# EAGLE design TeensyROM (EAGLE 7.7.0)
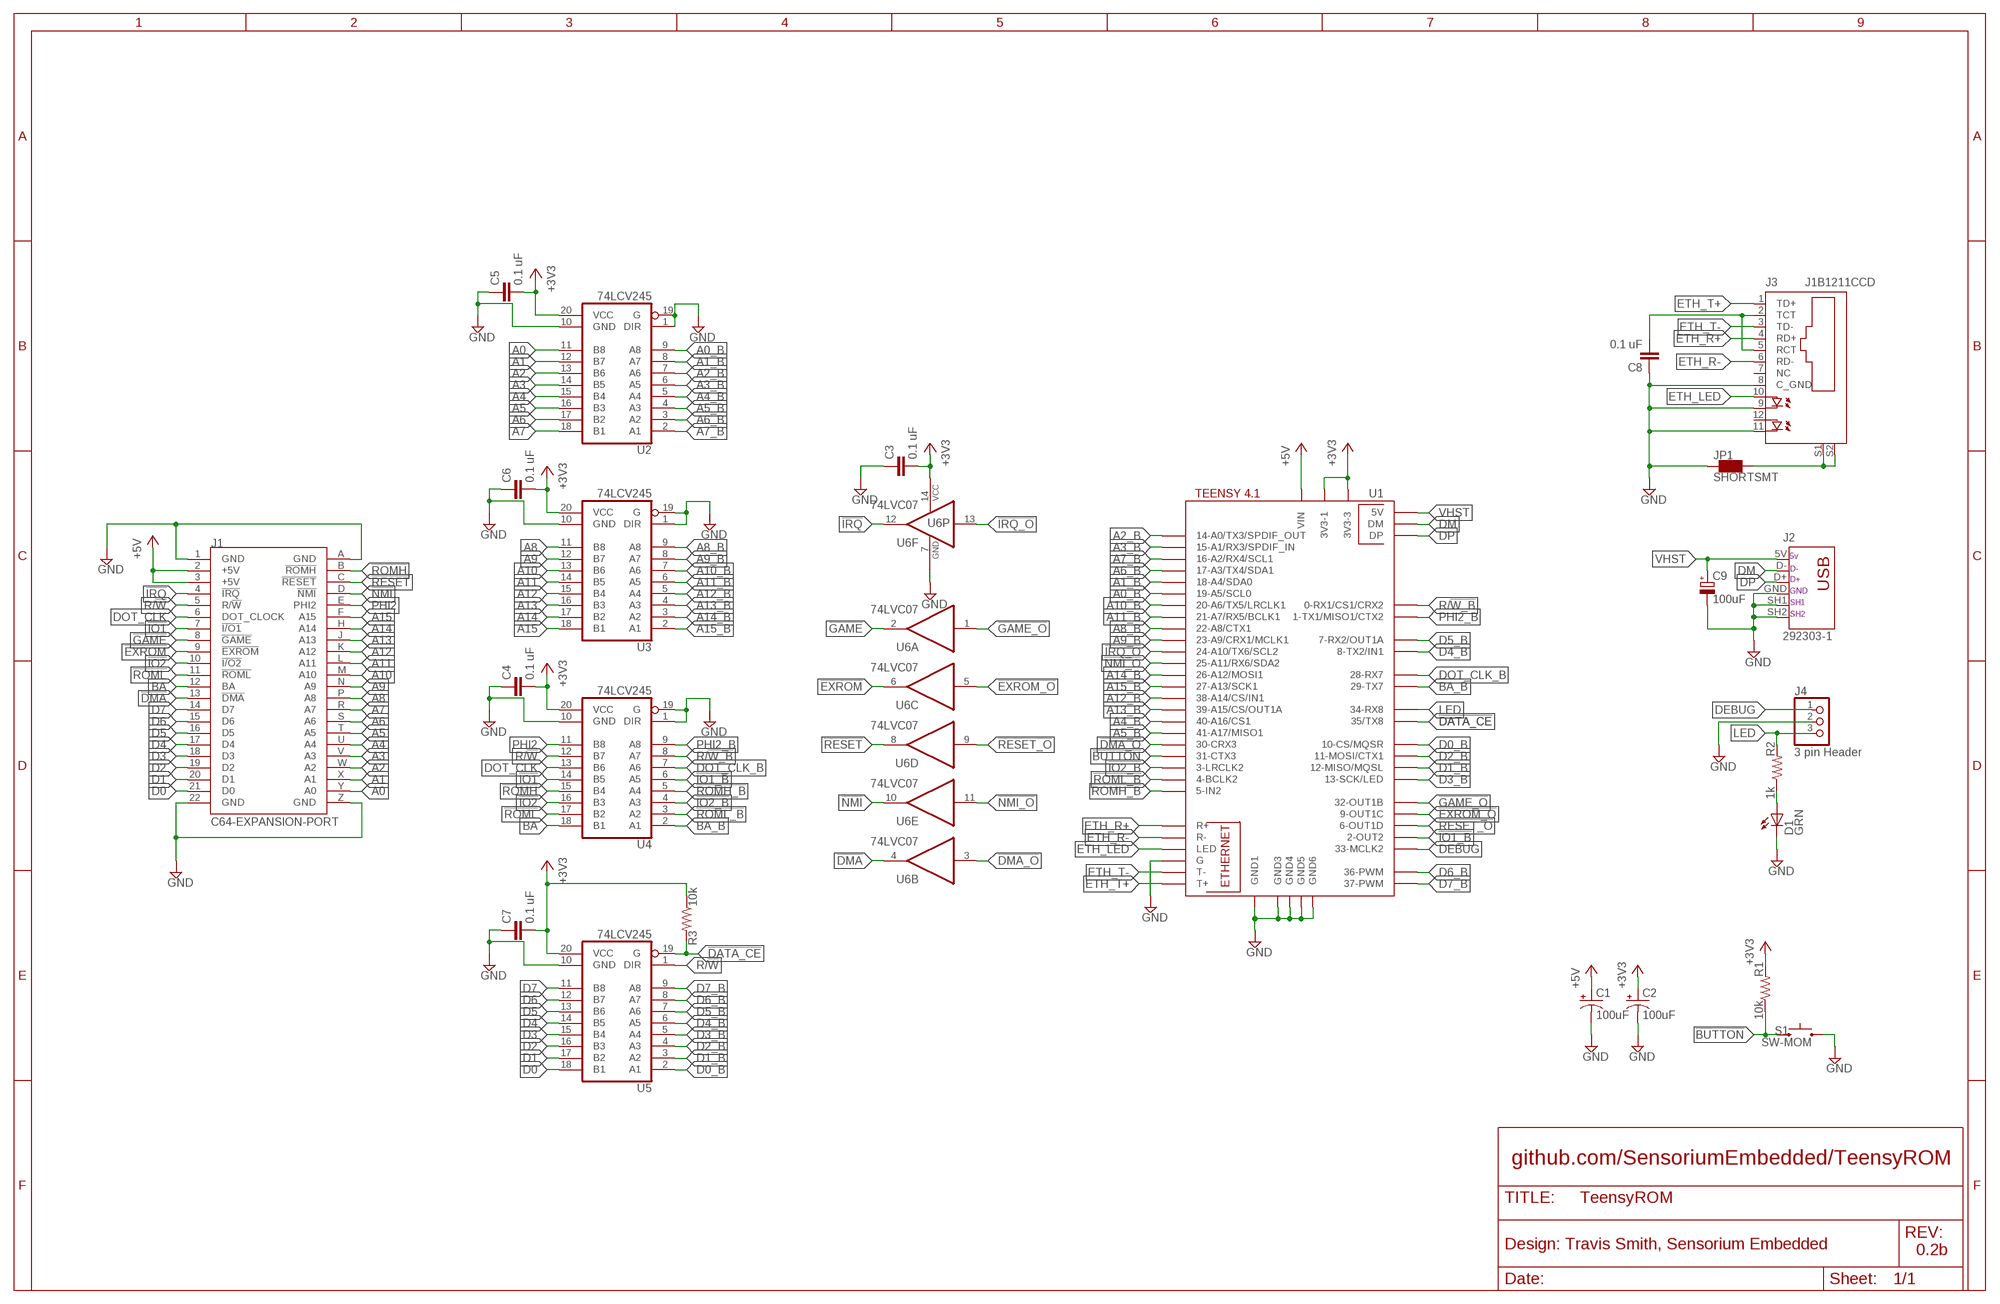
[diagram p0: schematic, sheet 1]

## Parts
C1  100uF  CPOL-USE2.5-6  [E2,5-6]
C2  100uF  CPOL-USE2.5-6  [E2,5-6]
C3  0.1 uF  CAP-0805-0.1UF-50V  [0805]
C4  0.1 uF  CAP-0805-0.1UF-50V  [0805]
C5  0.1 uF  CAP-0805-0.1UF-50V  [0805]
C6  0.1 uF  CAP-0805-0.1UF-50V  [0805]
C7  0.1 uF  CAP-0805-0.1UF-50V  [0805]
C8  0.1 uF  CAP-0805-0.1UF-50V  [0805]
C9  100uF  CPOL-EUA/3216-18W  [A/3216-18W]
D1  GRN  LED-3MM-GRN  [LED-3MM-PTH]
J1  C64-EXPANSION-PORT  C64-EXPANSIONPNARROW  [EXPANSIO_SQ]
J2  292303-1  USB-787616  [USB]
J3  J1B1211CCD  [CONN12_J1B1211CCD_WIZ]
J4  3 pin Header  PINHD-1X3  [1X03]
JP1  SHORTSMT  [SHORT]
R1  10k  R-US_R0805  [R0805]
R2  1k  R-US_R0805  [R0805]
R3  10k  R-US_R0805  [R0805]
S1  SW-MOM  SWITCH-MOMENTARY-2PTH  [TACTILE-PTH]
U1  TEENSY41  [TEENSY41]
U2  74LCV245  74LS245DW  [SO20W]
U3  74LCV245  74LS245DW  [SO20W]
U4  74LCV245  74LS245DW  [SO20W]
U5  74LCV245  74LS245DW  [SO20W]
U6  74LVC07  74LS07D  [SO14]

## Nets
!BUTTON: R1.1 S1.3 U1.31-CTX3
!DATA_CE: R3.2 U1.35-TX8(35/TX8) U5.19(G)
!DMA: J1.13(!DMA) U6.4(B:O)
!DMA_O: U1.30-CRX3 U6.3(B:I)
!EXROM: J1.9(!EXROM) U6.6(C:O)
!EXROM_O: U1.9-OUT1C U6.5(C:I)
!GAME: J1.8(!GAME) U6.2(A:O)
!GAME_O: U1.32-OUT1B U6.1(A:I)
!IO1: J1.7(!I/O1) U4.14(B5)
!IO1_B: U1.2-OUT2 U4.6(A5)
!IO2: J1.10(!I/O2) U4.16(B3)
!IO2_B: U1.3-LRCLK2 U4.4(A3)
!IRQ: J1.4(!IRQ) U6.12(F:O)
!IRQ_O: U1.24-A10/TX6/SCL2 U6.13(F:I)
!NMI: J1.D(!NMI) U6.10(E:O)
!NMI_O: U1.25-A11/RX6/SDA2 U6.11(E:I)
!RESET: J1.C(!RESET) U6.8(D:O)
!RESET_O: U1.6-OUT1D U6.9(D:I)
!ROMH: J1.B(!ROMH) U4.15(B4)
!ROMH_B: U1.5-IN2 U4.5(A4)
!ROML: J1.11(!ROML) U4.17(B2)
!ROML_B: U1.4-BCLK2 U4.3(A2)
+3V3: C2.+ C3.2 C4.2 C5.2 C6.2 C7.2 R1.2 R3.1 U1.3V3-1 U1.3V3-3 U2.20(VCC) U3.20(VCC) U4.20(VCC) U5.20(VCC) U6.14(P:VCC)
+5V: C1.+ J1.2(+5V) J1.3(+5V) U1.VIN
A0: J1.Y(A0) U2.11(B8)
A0_B: U1.19-A5/SCL0 U2.9(A8)
A1: J1.X(A1) U2.12(B7)
A1_B: U1.18-A4/SDA0 U2.8(A7)
A2: J1.W(A2) U2.13(B6)
A2_B: U1.14-A0/TX3/SPDIF_OUT U2.7(A6)
A3: J1.V(A3) U2.14(B5)
A3_B: U1.15-A1/RX3/SPDIF_IN U2.6(A5)
A4: J1.U(A4) U2.15(B4)
A4_B: U1.40-A16/CS1 U2.5(A4)
A5: J1.T(A5) U2.16(B3)
A5_B: U1.41-A17/MISO1 U2.4(A3)
A6: J1.S(A6) U2.17(B2)
A6_B: U1.17-A3/TX4/SDA1 U2.3(A2)
A7: J1.R(A7) U2.18(B1)
A7_B: U1.16-A2/RX4/SCL1 U2.2(A1)
A8: J1.P(A8) U3.11(B8)
A8_B: U1.22-A8/CTX1 U3.9(A8)
A9: J1.N(A9) U3.12(B7)
A9_B: U1.23-A9/CRX1/MCLK1 U3.8(A7)
A10: J1.M(A10) U3.13(B6)
A10_B: U1.20-A6/TX5/LRCLK1 U3.7(A6)
A11: J1.L(A11) U3.14(B5)
A11_B: U1.21-A7/RX5/BCLK1 U3.6(A5)
A12: J1.K(A12) U3.15(B4)
A12_B: U1.38-A14/CS/IN1 U3.5(A4)
A13: J1.J(A13) U3.16(B3)
A13_B: U1.39-A15/CS/OUT1A U3.4(A3)
A14: J1.H(A14) U3.17(B2)
A14_B: U1.26-A12/MOSI1 U3.3(A2)
A15: J1.F(A15) U3.18(B1)
A15_B: U1.27-A13/SCK1 U3.2(A1)
BA: J1.12(BA) U4.18(B1)
BA_B: U1.29-TX7 U4.2(A1)
D0: J1.21(D0) U5.18(B1)
D0_B: U1.10-CS\MQSR(10-CS/MQSR) U5.2(A1)
D1: J1.20(D1) U5.17(B2)
D1_B: U1.12-MISO/MQSL U5.3(A2)
D2: J1.19(D2) U5.16(B3)
D2_B: U1.11-MOSI/CTX1 U5.4(A3)
D3: J1.18(D3) U5.15(B4)
D3_B: U1.13-SCK/LED U5.5(A4)
D4: J1.17(D4) U5.14(B5)
D4_B: U1.8-TX2/IN1 U5.6(A5)
D5: J1.16(D5) U5.13(B6)
D5_B: U1.7-RX2/OUT1A U5.7(A6)
D6: J1.15(D6) U5.12(B7)
D6_B: U1.36-PWM U5.8(A7)
D7: J1.14(D7) U5.11(B8)
D7_B: U1.37-PWM U5.9(A8)
DEBUG: J4.1 U1.33-MCLK2
DM: J2.D- U1.DM
DOT_CLK: J1.6(DOT_CLOCK) U4.13(B6)
DOT_CLK_B: U1.28-RX7 U4.7(A6)
DP: J2.D+ U1.DP
ETH_CT: C8.2 J3.2(TCT) J3.5(RCT)
ETH_LED: J3.10(A) U1.LED
ETH_R+: J3.4(RD+) U1.R+
ETH_R-: J3.6(RD-) U1.R-
ETH_SH: J3.S1 J3.S2 JP1.2
ETH_T+: J3.1(TD+) U1.T+
ETH_T-: J3.3(TD-) U1.T-
GND: C1.- C2.- C3.1 C4.1 C5.1 C6.1 C7.1 C8.1 C9.- D1.K(C) J1.1(GND) J1.22(GND) J1.A(GND) J1.Z(GND) J2.GND J2.SH1 J2.SH2 J3.8(C_GND) J3.9(C) J3.11(C1) J4.2 JP1.1 S1.1 U1.G U1.GND1 U1.GND3 U1.GND4 U1.GND5 U1.GND6 U2.1(DIR) U2.10(GND) U2.19(G) U3.1(DIR) U3.10(GND) U3.19(G) U4.1(DIR) U4.10(GND) U4.19(G) U5.10(GND) U6.7(P:GND)
LED: J4.3 R2.2 U1.34-RX8
LED_R: D1.A R2.1
PHI2: J1.E(PHI2) U4.11(B8)
PHI2_B: U1.1-TX1/MISO1/CTX2 U4.9(A8)
R/!W: J1.5(R/!W) U4.12(B7) U5.1(DIR)
R/!W_B: U1.0-RX1/CS1/CRX2 U4.8(A7)
VHST: C9.+ J2.5V U1.+5V(5V)
Unconnected: J3.7(NC) J3.12(A1)

## Notes on the sheet
- github.com/SensoriumEmbedded/TeensyROM
- Design: Travis Smith, Sensorium Embedded
- 0.2b

## Library data of the parts
C1 C2 = rcl:CPOL-US: POLARIZED CAPACITOR, American symbol
C3 C5 = TeensyROM:CAP-0805-: Cap, 0805; DIGIKEY: 478-10836-2-ND; MANUF1: AVX Corporation; MANUF2: Matsushita; MPN1: 08055C104KAT4A; MPN2: NMC0805X7R104K50TRPF
C4 C6-C8 = cap:CAP-0805-: Cap, 0805; DIGIKEY: 478-10836-2-ND; MANUF1: AVX Corporation; MANUF2: Matsushita; MPN1: 08055C104KAT4A; MPN2: NMC0805X7R104K50TRPF
C9 = rcl:CPOL-EU: POLARIZED CAPACITOR, European symbol
D1 = Dolphin v3.20:LED-3MM-: LED 3.1MM PTH; DIGIKEY: 516-1293-ND; MANUF1: Broadcom Limited; MPN1: HLMP-1503
J1 = TeensyROM:C64-EXPANSIONP
J2 = TeensyROM:USB-787616: AMP connector
J3 = TeensyROM:J1B1211CCD; COPYRIGHT: Copyright (C) 2023 Ultra Librarian. All rights reserved.; MANUFACTURER_PART_NUMBER: J1B1211CCD; MFR_NAME: WIZnet
J4 = TeensyROM:PINHD-1X3: PIN HEADER
JP1 = TeensyROM:SHORT
R1-R3 = resistor:R-US_: RESISTOR, American symbol
S1 = AudioLooper:SWITCH-MOMENTARY-2
U1 = TeensyROM:TEENSY41
U2-U5 = TeensyROM:74*245: Octal BUS TRANSCEIVER, 3-state
U6 = TeensyROM:74*07: Hex BUFFER, open collector high-voltage output

## Net classes
1 vcc: width 0.254 mm

## Board
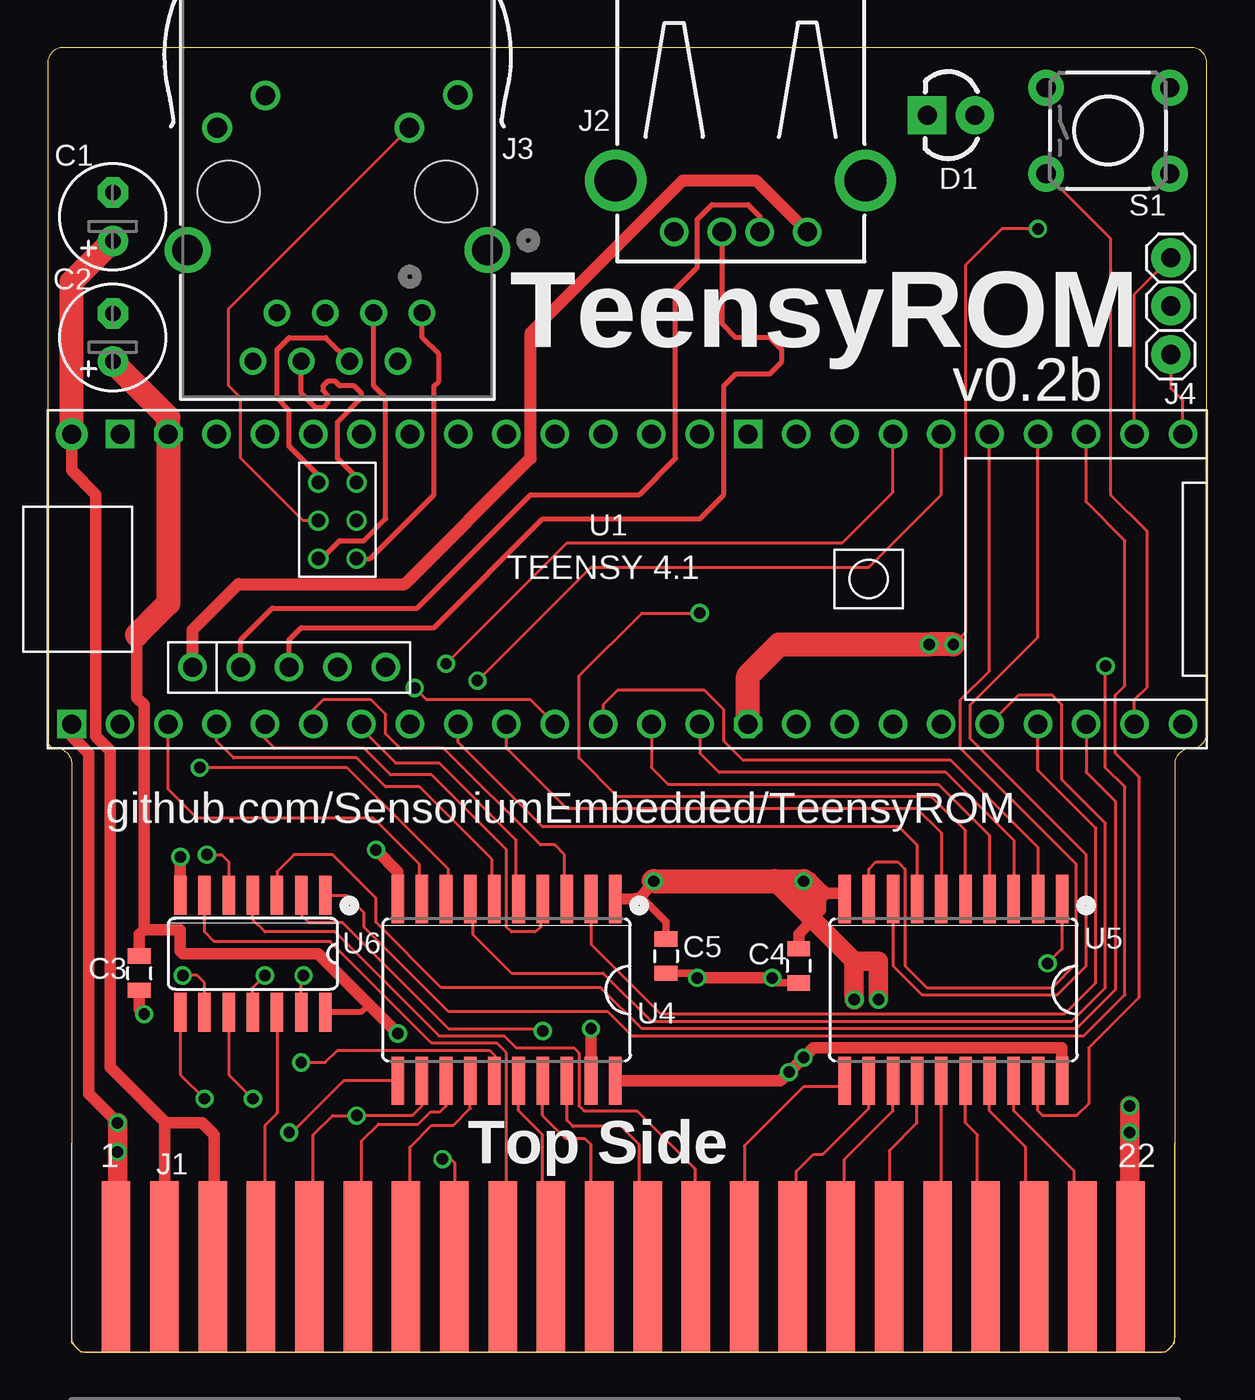
[diagram p1: board, top side]
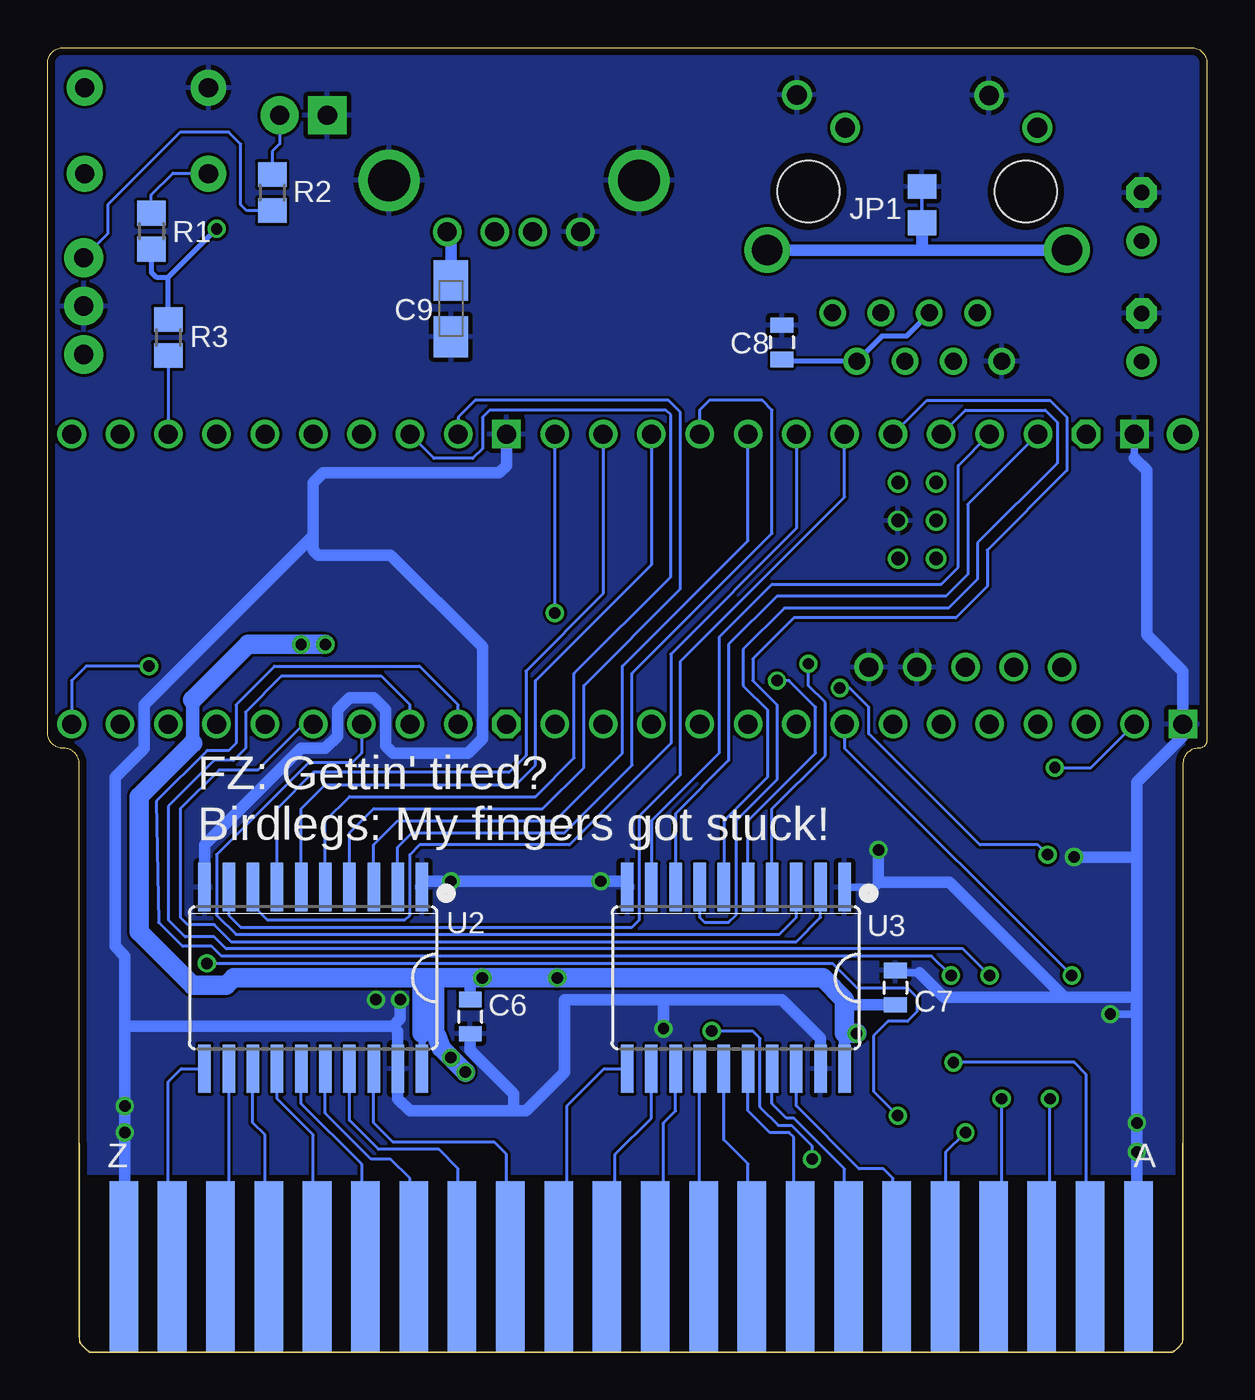
[diagram p2: board, bottom side, seen from below]

Size 60.96 x 68.58 mm. Coordinates in mm from the lower left corner, seen from the top.
Outline: 59.28,0.83 59.28,30.92 arc-90 60.11,31.75 60.13,31.75 arc90 60.96,32.58 60.96,67.75 arc90 60.13,68.58 0.82,68.58 arc90 0,67.75 0,32.19 arc90 0.44,31.75 arc-90 1.27,30.92 1.27,0.83 arc90 2.1,0 58.46,0 arc90 59.28,0.83
Copper layers (1*16): Top 0.0356mm / dielectric 1.5011mm / Bottom 0.0356mm
Design rules "oshpark-2layer *": minimum track width 6mil, minimum drill 13mil, track to track 6mil, track to pad 6mil, pad to pad 6mil, via to via 6mil, smd to smd 6mil, copper to edge 15mil, drill to drill 6mil, minimum pad ring 7mil, minimum via ring 7mil, stop-mask expansion 2.5mil, vias tented up to drill 24mil, thermal gap 10mil

### Footprints (pad centres in the part's own frame; a part is rotated, then mirrored left to right if it is on the bottom)
E2,5-6 = drill 0.813 pad 1.6: + -1.27,0 | drill 0.813 pad 1.6 octagon: - 1.27,0
0805 = smd 0.8 x 1.2: 1 -0.9,0; 2 0.9,0
A/3216-18W = smd 2.15 x 1.8: + 1.475,0; - -1.475,0
LED-3MM-PTH = drill 1 pad 2: A -1.25,0 | drill 1 pad 2 square: K 1.25,0
EXPANSIO_SQ = smd 1.5 x 9: 1 26.67,-4.5; 2 24.13,-4.5; 3 21.59,-4.5; 4 19.05,-4.5; 5 16.51,-4.5; 6 13.97,-4.5; 7 11.43,-4.5; 8 8.89,-4.5; 9 6.35,-4.5; 10 3.81,-4.5; 11 1.27,-4.5; 12 -1.27,-4.5; 13 -3.81,-4.5; 14 -6.35,-4.5; 15 -8.89,-4.5; 16 -11.43,-4.5; 17 -13.97,-4.5; 18 -16.51,-4.5; 19 -19.05,-4.5; 20 -21.59,-4.5; 21 -24.13,-4.5; 22 -26.67,-4.5 | smd 1.5 x 9 bottom: A 26.67,-4.5; B 24.13,-4.5; C 21.59,-4.5; D 19.05,-4.5; E 16.51,-4.5; F 13.97,-4.5; H 11.43,-4.5; J 8.89,-4.5; K 6.35,-4.5; L 3.81,-4.5; M 1.27,-4.5; N -1.27,-4.5; P -3.81,-4.5; R -6.35,-4.5; S -8.89,-4.5; T -11.43,-4.5; U -13.97,-4.5; V -16.51,-4.5; W -19.05,-4.5; X -21.59,-4.5; Y -24.13,-4.5; Z -26.67,-4.5
USB = drill 1: 5V -3.5,12.99; D+ 1,12.99; D- -1,12.99; GND 3.5,12.99 | drill 2.2: SH1 -6.553,10.287; SH2 6.579,10.287
CONN12_J1B1211CCD_WIZ = drill 0.889 pad 1.397: 1 -4.445,5.055; 2 -3.175,7.595; 3 -1.905,5.055; 4 -0.635,7.595; 5 0.635,5.055; 6 1.905,7.595; 7 3.175,5.055; 8 4.445,7.595 | drill 1.041 pad 1.549: 9 -6.325,-6.401; 10 -3.785,-4.674; 11 3.785,-6.375; 12 6.325,-4.674 | drill 1.6 pad 2.108: S1 -7.874,1.753; S2 7.874,1.753 | hole 3.251: -5.715,-1.321; 5.715,-1.321
1X03 = drill 1.016 pad 2.032: 1 -2.54,0; 2 0,0; 3 2.54,0
SHORT = smd 1.3 x 1.5: 1 -0.95,0; 2 0.95,0
R0805 = smd 1.3 x 1.5: 1 -0.95,0; 2 0.95,0
TACTILE-PTH = drill 1.016 pad 1.88: 1 -3.251,2.261; 2 3.251,2.261; 3 -3.251,-2.261; 4 3.251,-2.261
TEENSY41 = drill 1: 0-RX1/CS1/CRX2 -27.94,-7.62; 1-TX1/MISO1/CTX2 -25.4,-7.62; 2-OUT2 -22.86,-7.62; 3-LRCLK2 -20.32,-7.62; 4-BCLK2 -17.78,-7.62; 5-IN2 -15.24,-7.62; 6-OUT1D -12.7,-7.62; 7-RX2/OUT1A -10.16,-7.62; 8-TX2/IN1 -7.62,-7.62; 9-OUT1C -5.08,-7.62; 10-CS\MQSR -2.54,-7.62; 11-MOSI/CTX1 0,-7.62; 12-MISO/MQSL 2.54,-7.62; 13-SCK/LED 2.54,7.62; 14-A0/TX3/SPDIF_OUT 0,7.62; 15-A1/RX3/SPDIF_IN -2.54,7.62; 16-A2/RX4/SCL1 -5.08,7.62; 17-A3/TX4/SDA1 -7.62,7.62; 18-A4/SDA0 -10.16,7.62; 19-A5/SCL0 -12.7,7.62; 20-A6/TX5/LRCLK1 -15.24,7.62; 21-A7/RX5/BCLK1 -17.78,7.62; 22-A8/CTX1 -20.32,7.62; 23-A9/CRX1/MCLK1 -22.86,7.62; 24-A10/TX6/SCL2 7.62,-7.62; 25-A11/RX6/SDA2 10.16,-7.62; 26-A12/MOSI1 12.7,-7.62; 27-A13/SCK1 15.24,-7.62; 28-RX7 17.78,-7.62; 29-TX7 20.32,-7.62; 30-CRX3 22.86,-7.62; 31-CTX3 25.4,-7.62; 32-OUT1B 27.94,-7.62; 33-MCLK2 27.94,7.62; 34-RX8 25.4,7.62; 35-TX8 22.86,7.62; 36-PWM 20.32,7.62; 37-PWM 17.78,7.62; 38-A14/CS/IN1 15.24,7.62; 39-A15/CS/OUT1A 12.7,7.62; 40-A16/CS1 10.16,7.62; 41-A17/MISO1 7.62,7.62; +5V -24.13,-4.62; DM -21.59,-4.62; DP -19.05,-4.62; GND4 -16.51,-4.62; GND5 -13.97,-4.62 | drill 1 octagon: 3V3-1 5.08,-7.62; 3V3-3 -25.4,7.62 | drill 0.7: G -15.51,3.08; LED -17.51,3.08; R+ -17.51,5.08; R- -15.51,5.08; T+ -15.51,1.08; T- -17.51,1.08 | drill 1 square: GND1 -30.48,-7.62; GND3 5.08,7.62; GND6 -27.94,7.62 | drill 1 pad 1.676: VIN -30.48,7.62
SO20W = smd 0.66 x 2.54: 1 -5.715,-4.775; 2 -4.445,-4.775; 3 -3.175,-4.775; 4 -1.905,-4.775; 5 -0.635,-4.775; 6 0.635,-4.775; 7 1.905,-4.775; 8 3.175,-4.775; 9 4.445,-4.775; 10 5.715,-4.775; 11 5.715,4.775; 12 4.445,4.775; 13 3.175,4.775; 14 1.905,4.775; 15 0.635,4.775; 16 -0.635,4.775; 17 -1.905,4.775; 18 -3.175,4.775; 19 -4.445,4.775; 20 -5.715,4.775
SO14 = smd 0.66 x 2.032: 1 -3.81,-3.073; 2 -2.54,-3.073; 3 -1.27,-3.073; 4 0,-3.073; 5 1.27,-3.073; 6 2.54,-3.073; 7 3.81,-3.073; 8 3.81,3.073; 9 2.54,3.073; 10 1.27,3.073; 11 0,3.073; 12 -1.27,3.073; 13 -2.54,3.073; 14 -3.81,3.073

### Placement (x,y rotation side)
C1  3.43,59.69 90 top
C2  3.43,53.34 90 top
C3  4.83,19.94 90 top
C4  39.5,20.32 270 top
C5  32.51,20.83 270 top
C6  38.74,17.65 90 bottom
C7  16.38,19.18 270 bottom
C8  22.35,53.09 270 bottom
C9  39.75,54.86 90 bottom
D1  47.5,65.02 180 top
J1  30.28,0 180 top
J2  36.45,71.88 180 top
J3  15.24,59.69 180 top
J4  59.05,54.99 90 top
JP1  14.99,60.33 270 bottom
R1  55.5,58.93 270 bottom
R2  49.15,60.96 270 bottom
R3  54.61,53.34 270 bottom
S1  55.75,64.21 0 top
U1  31.75,40.64 0 top
U2  46.99,19.68 180 bottom
U3  24.77,19.68 180 bottom
U4  24.13,19.05 180 top
U5  47.62,19.05 180 top
U6  10.79,20.95 180 top

### Tracks (layer width: path | path; a pad name or v marks a point on that pad's centre or on a via)
!BUTTON
  Top 0.152: U1.31-CTX3 57.15,34.29 57.79,34.92 57.79,43.18 55.88,45.09 55.88,58.55 52.5,61.92 S1.3
  Bottom 0.152: R1.1 55.5,60.83 54.36,61.98 52.53,61.98 S1.3
!DATA_CE
  Top 0.152: U1.35-TX8 54.61,44.7 56.64,42.67 56.64,35.05 56.13,34.54 56.13,31.5 57.4,30.23 57.4,18.67 54.74,16 54.74,13.08 54.1,12.45 52.32,12.45 52.07,12.7 U5.19
  Bottom 0.152: R3.2 U1.35-TX8
!DMA
  Top 0.152: J1.13 34.29,6.6 34.04,6.85 34.04,9.65 30.99,12.7 28.19,12.7 27.94,12.95 27.94,15.75 27.69,16 24.64,16 24,16.64 20.57,16.64 15.11,22.1 11.43,22.1 10.79,22.73 U6.4
!DMA_O
  Top 0.152: U1.30-CRX3 54.61,30.48 56.13,28.96 56.13,19.05 54.1,17.02 31.24,17.02 29.08,19.18 20.7,19.18 17.27,22.61 17.27,23.88 14.99,26.16 12.95,26.16 12.06,25.27 U6.3
!EXROM
  Top 0.152: J1.9 24.13,6.6 24.13,15.75 23.62,16.26 20.19,16.26 14.86,21.59 8.76,21.59 8.26,22.1 U6.6
!EXROM_O  (via drill 0.6)
  Top 0.152: U1.9-OUT1C 25.4,34.29 19.94,34.29 v19.3,34.92 | v8.38,26.16 9.14,26.16 9.53,25.78 U6.5
  Bottom 0.152: v8.38,26.16 8.89,26.67 11.94,26.67 17.78,32.51 17.78,33.91 18.8,34.92 v19.3,34.92
!GAME  (via drill 0.6)
  Top 0.152: v20.76,10.16 21.21,10.16 21.4,9.97 J1.8 | U6.2 13.33,22.99 13.72,22.61 15.49,22.61 21.08,17.02 25.91,17.02 v26.04,16.89
  Bottom 0.152: v26.04,16.89 23.88,16.89 23.5,16.51 23.5,12.89 22.54,11.94 21.84,11.94 20.76,10.86 v20.76,10.16
!GAME_O  (via drill 0.6)
  Top 0.152: v55.63,36.07 55.63,30.73 56.64,29.72 56.64,18.8 54.48,16.64 30.73,16.64 29.46,17.91 21.08,17.91 16.64,22.35 16.64,23.11 15.75,24 14.63,24 U6.1
  Bottom 0.152: v55.63,36.07 58.93,36.07 59.69,35.31 U1.32-OUT1B
!IO1
  Top 0.152: J1.7 19.05,6.6 19.05,10.79 20.19,11.94 21.34,11.94 22.22,12.83 U4.14
!IO1_B
  Top 0.152: U4.6 23.37,24.21 23.37,25.91 19.56,29.72 17.78,29.72 16.26,31.24 9.78,31.24 8.89,32.13 U1.2-OUT2
!IO2
  Top 0.152: J1.10 26.04,6.85 26.04,11.43 24.77,12.7 U4.16
!IO2_B
  Top 0.152: U4.4 25.91,23.95 25.91,22.35 25.65,22.1 24.38,22.1 24.13,22.35 24.13,26.42 20.19,30.35 18.03,30.35 16.64,31.75 11.94,31.75 11.43,32.26 U1.3-LRCLK2
!IRQ
  Top 0.152: J1.4 11.43,6.6 11.43,11.94 12.06,12.57 U6.12
!IRQ_O  (via drill 0.6)
  Top 0.152: U6.13 13.33,19.68 v13.46,19.81
  Bottom 0.152: U1.24-A10/TX6/SCL2 39.37,34.04 41.4,36.07 49.02,36.07 51.05,34.04 51.05,32 51.44,31.62 52.58,31.62 55.25,28.96 55.12,22.61 53.85,21.34 52.32,21.34 51.82,20.83 14.48,20.83 v13.46,19.81
!NMI  (via drill 0.6)
  Top 0.152: U6.10 9.53,14.61 v10.79,13.34
  Bottom 0.152: J1.D 10.79,6.85 v10.79,13.34
!NMI_O  (via drill 0.6)
  Top 0.152: U6.11 10.79,19.18 v11.43,19.81
  Bottom 0.152: U1.25-A11/RX6/SDA2 41.91,34.04 43.43,35.56 48.64,35.56 50.55,33.66 50.55,31.75 51.18,31.11 52.2,31.11 54.61,28.7 54.61,22.73 53.72,21.84 52.2,21.84 51.56,21.21 12.83,21.21 v11.43,19.81
!RESET  (via drill 0.6)
  Top 0.152: U6.8 6.98,14.61 v8.26,13.34
  Bottom 0.152: J1.C 8.26,6.85 v8.26,13.34
!RESET_O  (via drill 0.6)
  Top 0.152: U6.9 8.26,19.43 7.87,19.81 v7.11,19.81
  Bottom 0.152: U1.6-OUT1D 19.05,31.75 v7.11,19.81
!ROMH  (via drill 0.6)
  Top 0.152: v13.33,15.24 14.61,15.24 15.24,15.88 23.24,15.88 23.5,15.62 U4.15
  Bottom 0.152: v13.33,15.24 6.98,15.24 6.35,14.61 6.35,8.89 6.16,8.7 J1.B
!ROMH_B
  Top 0.152: U4.5 24.64,24.21 24.64,26.92 20.57,30.99 18.29,30.99 16.51,32.77 U1.5-IN2
!ROML
  Top 0.152: J1.11 28.57,6.85 28.57,10.92 28.26,11.24 27.24,11.24 26.04,12.45 U4.17
!ROML_B
  Top 0.152: U4.3 27.18,24.21 27.18,26.16 26.67,26.67 25.91,26.67 20.83,31.75 18.54,31.75 17.78,32.51 17.78,33.53 17.02,34.29 14.48,34.29 13.97,33.78 U1.4-BCLK2
+3V3  (via drill 0.6)
  Top 0.152: v52.07,59.05 50.17,59.05 48.26,57.15 48.26,37.85 v47.62,37.21
  Top 0.305: U6.14 14.63,17.91 16.51,17.91 16.89,18.29
  Top 0.406: C4.2 38.37,19.42 v38.1,19.68 | 6.98,21.08 7.11,20.95 | C5.2 33.92,19.93 v34.16,19.68
  Top 0.61: U4.20 38.53,14.28 v38.99,14.73 v39.75,15.49 40.26,16 53.34,16 U5.20 | 7.11,20.95 14.22,20.95 16.89,18.29 v18.41,16.76 | v38.1,19.68 v34.16,19.68 | 6.98,21.08 6.98,22.23 5.08,22.23 | 4.7,37.72 4.7,34.42 5.08,34.04 5.08,22.23 | C3.2 4.83,21.97 5.08,22.23
  Top 1.27: U1.3V3-1 36.83,35.56 38.48,37.21 v46.36,37.21 v47.62,37.21 | 4.7,37.72 6.35,39.37 U1.3V3-3 6.35,49.15 C2.+
  Bottom 0.254: R3.1 54.61,56.52 | 54.61,56.52 v52.07,59.05 | R1.2 55.5,56.77 55.25,56.52 54.61,56.52
  Bottom 0.406: U2.20 41.28,16.76
  Bottom 0.61: 19.05,16.76 U3.20 | C6.2 38.74,19.68 | C7.2 18.91,18.28 19.05,18.41
  Bottom 0.711: 53.34,34.29 53.34,32
  Bottom 0.813: 40.26,19.56 40.64,19.3 40.51,19.18 40.51,16.64 41.15,17.27 41.28,17.27
  Bottom 1.016: v46.36,37.21 50.42,37.21 53.34,34.29 | 41.28,16.76 41.28,17.27 41.28,19.68 | 41.28,19.68 38.74,19.68 v34.16,19.68 20.19,19.68 19.05,18.54 19.05,18.41 19.05,16.76 v18.41,16.76 | 41.28,19.68 51.18,19.68 51.56,19.3 53.34,19.3 56.13,22.1 56.13,29.21 53.34,32 | 40.51,16.64 40.26,16 v38.99,14.73
+5V
  Top 0.61: J1.3 8.76,6.47 8.76,11.43 8.13,12.06 6.22,12.06 | 6.22,12.06 6.16,12 J1.2 | 6.22,12.06 3.3,14.99 3.3,31.62 2.54,32.38 2.54,45.09 1.27,46.35 U1.VIN
  Top 1.27: U1.VIN 1.27,56.26 C1.+
A0
  Bottom 0.152: J1.Y 54.61,6.6 54.61,14.22 53.92,14.91 U2.11
A0_B
  Bottom 0.152: U2.9 51.44,22.99 50.8,22.35 30.23,22.35 29.84,22.73 29.84,28.19 27.69,30.35 27.69,36.32 19.05,44.96 U1.19-A5/SCL0
A1
  Bottom 0.152: J1.X 51.44,6.85 U2.12
A1_B
  Bottom 0.152: U1.18-A4/SDA0 21.59,43.31 28.19,36.7 28.19,32 33.53,26.67 41.4,26.67 41.91,26.16 41.91,22.99 42.16,22.73 49.4,22.73 50.17,23.5 U2.8
A2
  Bottom 0.152: J1.W 49.53,6.6 49.53,11.43 50.17,12.06 U2.13
A2_B
  Bottom 0.152: U1.14-A0/TX3/SPDIF_OUT 31.75,39.88 35.81,35.81 35.81,31.37 36.7,30.48 46.99,30.48 48.9,28.57 U2.7
A3
  Bottom 0.152: J1.V 46.99,6.6 46.99,11.43 48.9,13.34 U2.14
A3_B
  Bottom 0.152: U2.6 47.62,28.57 46.36,29.84 36.32,29.84 35.31,30.86 35.31,35.31 29.21,41.4 U1.15-A1/RX3/SPDIF_IN
A4
  Bottom 0.152: J1.U 44.43,6.4 | 44.43,6.4 44.45,6.6 | U2.15 47.62,13.08 44.45,9.91 44.45,6.42 44.43,6.4
A4_B
  Bottom 0.152: U2.5 46.36,27.94 45.09,29.21 35.31,29.21 33.27,31.24 33.27,35.69 28.19,40.77 28.19,49.28 28.45,49.53 37.72,49.53 38.1,49.15 38.1,47.5 38.61,46.99 40.64,46.99 U1.40-A16/CS1
A5
  Bottom 0.152: J1.T 41.91,6.6 41.91,9.14 42.93,10.16 43.94,10.16 46.36,12.57 U2.16
A5_B
  Bottom 0.152: U2.4 45.09,27.3 43.82,28.57 34.93,28.57 32.77,30.73 32.77,35.05 27.69,40.13 27.69,49.4 28.32,50.04 38.48,50.04 39.37,49.15 U1.41-A17/MISO1
A6
  Bottom 0.152: J1.S 39.37,6.6 39.37,9.65 40.39,10.67 43.56,10.67 45.09,12.19 U2.17
A6_B
  Bottom 0.152: U2.3 43.82,26.67 42.55,27.94 34.29,27.94 30.73,31.5 30.73,36.07 24.13,42.67 U1.17-A3/TX4/SDA1
A7
  Bottom 0.152: J1.R 36.83,6.6 36.83,10.41 37.47,11.05 42.8,11.05 43.82,12.06 U2.18
A7_B
  Bottom 0.152: U2.2 42.55,26.54 41.78,27.3 33.78,27.3 30.23,30.86 30.23,35.69 22.86,43.05 22.86,49.53 23.37,50.04 26.16,50.04 26.67,49.53 U1.16-A2/RX4/SCL1
A8
  Bottom 0.152: J1.P 33.66,6.85 33.66,12.95 31.7,14.91 U3.11
A8_B
  Bottom 0.152: U1.22-A8/CTX1 13.08,46.61 13.08,41.27 13.97,40.39 22.86,40.39 25.65,37.59 25.65,31.5 29.21,27.94 U3.9
A9
  Bottom 0.152: J1.N 31.11,6.85 31.11,10.41 29.21,12.32 U3.12
A9_B
  Bottom 0.152: U1.23-A9/CRX1/MCLK1 12.57,44.58 12.57,40.89 13.72,39.75 22.61,39.75 25.15,37.21 25.15,31.11 27.94,28.32 U3.8
A10
  Bottom 0.152: J1.M 28.57,6.85 28.57,12.06 27.94,12.7 U3.13
A10_B
  Bottom 0.152: U1.20-A6/TX5/LRCLK1 14.73,50.04 8.26,50.04 7.37,49.15 7.37,46.35 11.56,42.16 11.56,40.26 13.21,38.61 21.72,38.61 23.88,36.45 23.88,35.31 22.61,34.04 22.61,30.1 24.77,27.94 24.77,22.99 25.15,22.61 26.42,22.61 26.67,22.86 U3.7
A11
  Bottom 0.152: J1.L 26.67,6.6 U3.14
A11_B
  Bottom 0.152: U1.21-A7/RX5/BCLK1 12.7,49.53 8.51,49.53 7.87,48.9 7.87,46.74 12.06,42.55 12.06,40.64 13.59,39.12 22.22,39.12 24.38,36.96 24.38,35.05 23.11,33.78 23.11,30.23 25.4,27.94 U3.6
A12
  Bottom 0.152: J1.K 24.13,6.6 24.13,9.91 25.4,11.18 U3.15
A12_B  (via drill 0.6)
  Top 0.152: v22.61,35.31 28.57,41.27 43.18,41.27 46.99,45.09 U1.38-A14/CS/IN1
  Bottom 0.152: U3.5 24.13,27.94 20.57,31.5 20.57,33.91 21.97,35.31 v22.61,35.31
A13
  Bottom 0.152: J1.J 21.72,6.72 21.72,11.3 21.97,11.56 22.99,11.56 24.13,12.7 U3.16
A13_B  (via drill 0.6)
  Top 0.152: v20.95,36.2 27.3,42.55 41.78,42.55 44.45,45.21 U1.39-A15/CS/OUT1A
  Bottom 0.152: U3.4 22.86,28.57 20.07,31.37 20.07,34.16 20.95,35.05 v20.95,36.2
A14
  Bottom 0.152: J1.H 19.05,6.6 19.05,9.65 21.72,12.32 22.1,12.32 22.86,13.08 U3.17
A14_B
  Bottom 0.152: U1.26-A12/MOSI1 44.45,31.5 44.96,30.99 47.24,30.99 52.07,26.16 52.07,22.99 51.05,21.97 22.48,21.97 21.59,22.86 U3.3
A15
  Bottom 0.152: J1.F 16.51,6.6 16.51,9.14 17.02,9.65 18.29,9.65 21.59,12.95 U3.18
A15_B
  Bottom 0.152: U1.27-A13/SCK1 47.5,33.02 49.91,30.61 51.94,30.61 53.98,28.57 53.98,22.86 53.59,22.48 52.2,22.48 51.31,21.59 21.59,21.59 20.32,22.86 U3.2
BA
  Top 0.152: J1.12 31.11,6.85 31.11,10.92 30.16,11.87 27.62,11.87 27.3,12.19 U4.18
BA_B
  Top 0.152: U4.2 28.57,21.46 32.26,17.78 53.47,17.78 55.12,19.43 55.12,27.56 52.07,30.61 U1.29-TX7
D0
  Top 0.152: J1.21 53.98,6.85 53.98,9.53 50.8,12.7 U5.18
D0_B
  Top 0.152: U1.10-CS\MQSR 29.21,34.04 29.97,34.8 34.54,34.8 35.56,33.78 35.56,32.13 36.58,31.11 47.5,31.11 52.07,26.54 U5.2
D1
  Top 0.152: J1.20 51.44,6.85 51.44,10.79 49.53,12.7 U5.17
D1_B
  Top 0.152: U5.3 50.8,26.92 47.24,30.48 35.31,30.48 34.29,31.5 U1.12-MISO/MQSL
D2
  Top 0.152: J1.19 48.9,6.85 48.9,11.43 48.26,12.06 U5.16
D2_B
  Top 0.152: U5.4 49.53,27.18 46.86,29.84 32.64,29.84 31.75,30.73 U1.11-MOSI/CTX1
D3
  Top 0.152: J1.18 46.99,6.6 U5.15
D3_B  (via drill 0.6)
  Top 0.152: U5.5 48.26,27.43 46.48,29.21 29.97,29.21 27.94,31.24 27.94,35.56 31.24,38.86 v34.29,38.86
  Bottom 0.152: v34.29,38.86 U1.13-SCK/LED
D4
  Top 0.152: J1.17 44.26,10.6 45.72,12.06 U5.14
D4_B
  Top 0.152: U1.8-TX2/IN1 24.13,31.75 27.3,28.57 45.72,28.57 46.99,27.3 U5.6
D5
  Top 0.152: J1.16 41.91,6.6 41.91,10.16 44.45,12.7 U5.13
D5_B
  Top 0.152: U1.7-RX2/OUT1A 21.59,32.07 26.04,27.62 44.77,27.62 45.72,26.67 U5.7
D6
  Top 0.152: J1.15 39.37,6.6 39.37,9.53 40.26,10.41 40.77,10.41 43.18,12.83 U5.12
D6_B
  Top 0.152: U5.8 44.45,20.32 45.97,18.8 53.09,18.8 54.61,20.32 54.61,26.16 48.51,32.26 48.51,34.04 52.07,37.59 U1.36-PWM
D7
  Top 0.152: J1.14 36.64,10.86 39.75,13.97 41.86,13.97 U5.11
D7_B
  Top 0.152: U5.9 43.18,25.4 43.56,25.78 44.7,25.78 45.09,25.4 45.09,20.32 46.23,19.18 52.83,19.18 54.1,20.45 54.1,25.65 48.01,31.75 48.01,34.29 49.53,35.81 U1.37-PWM
DEBUG
  Top 0.152: U1.33-MCLK2 59.69,50.04 59.05,50.67 J4.1
DM
  Top 0.254: U1.DM 10.16,37.47 11.81,39.12 19.43,39.12 25.4,45.09 31.11,45.09 33.02,46.99 33.02,55.88 34.16,57.02 34.16,59.56 34.93,60.33 36.83,60.33 37.47,59.69 37.47,58.91 J2.D-
DOT_CLK
  Top 0.152: J1.6 16.51,6.6 16.51,11.11 17.4,12 19.49,12 20.13,12.64 20.64,12.64 20.95,12.95 U4.13
DOT_CLK_B
  Top 0.152: U4.7 22.35,23.95 22.35,21.97 24.38,19.94 29.21,19.94 31.75,17.4 53.85,17.4 55.63,19.18 55.63,27.81 53.34,30.1 53.34,34.04 52.83,34.54 51.05,34.54 U1.28-RX7
DP
  Top 0.254: U1.DP 12.7,37.47 13.33,38.1 20.32,38.1 26.04,43.81 34.29,43.81 35.56,45.09 35.56,50.8 36.2,51.44 37.97,51.44 38.61,52.07 38.61,52.7 37.97,53.34 36.2,53.34 35.45,54.09 J2.D+
ETH_CT
  Bottom 0.254: J3.5 14.61,54.61 15.8,53.42 17.09,53.42 J3.2 22.26,52.09 C8.2
ETH_LED
  Top 0.152: U1.LED 13.43,43.72 10.16,46.99 10.16,50.16 9.53,50.8 9.53,54.86 J3.10
ETH_R+
  Top 0.254: U1.R+ 14.24,46.09 12.7,47.62 12.7,49.53 12.06,50.16 12.06,52.7 12.7,53.34 14.63,53.34 J3.4
ETH_R-
  Top 0.254: U1.R- 16.24,45.99 15.24,46.99 15.24,48.9 16.51,50.16 16.51,50.42 16.13,50.8 15.37,50.8 15.11,51.05 14.73,51.05 14.48,50.8 14.48,50.55 14.73,50.29 14.73,49.91 14.48,49.66 14.1,49.66 13.33,50.42 J3.6
ETH_SH
  Bottom 0.61: J3.S2 15.11,57.94 J3.S1
  Bottom 0.635: JP1.2 14.99,58.06 15.11,57.94
ETH_T+
  Top 0.254: U1.T+ 16.96,41.72 20.32,45.09 20.32,50.8 20.57,51.05 20.57,52.45 19.68,53.34 J3.1
ETH_T-
  Top 0.254: U1.T- 14.41,41.72 15.37,42.67 16.64,42.67 17.78,43.81 17.78,50.16 17.14,50.8 J3.3
GND  (via drill 0.6)
  Top 0.152: 43.68,18.55 v43.69,18.54 | 40.64,23.24 40.26,23.24 40.01,23.5
  Top 0.406: C5.1 32.51,22.63 31.19,23.95
  Top 0.61: J1.Z 56.9,6.47 | J1.A 3.68,6.47 | v3.68,12.06 2.16,13.59 2.16,31.5 1.27,32.38 U1.GND1 | U4.1 30.89,23.84 31.19,23.95 v31.88,24.77 | v39.75,24.77 40.01,24.77 | U5.10 41.86,24.13 40.64,24.13 40.64,23.24 39.5,21.97 C4.1 | U4.19 v28.57,17.02 | U4.10 18.41,25.27 v17.27,26.42 | U6.7 v6.98,26.04 | C3.1 4.83,18.03 v5.08,17.78
  Top 1.016: 56.9,6.47 v56.9,12.95 | v3.68,12.06 3.68,6.47 | 38.23,24.77 42.41,20.59 42.41,18.81 v42.42,18.54 | 43.68,18.55 43.68,20.56 42.53,20.56 | 40.01,24.77 40.64,24.13 | 39.37,24.13 40.01,23.5
  Top 1.27: v31.88,24.77 38.23,24.77 v39.75,24.77
  Bottom 0.406: 3.81,46.99 U1.GND6 | v5.08,17.78 3.81,17.78 3.68,22.99 | U3.1 17.4,24.46 17.14,24.71 | 15.12,19.95 16.26,19.95 C7.1
  Bottom 0.61: 56.9,17.14 v56.9,12.95 56.9,6.47 J1.Z | U3.10 30.53,24.77 v39.75,24.77 41.22,24.77 U2.1 | 46.99,42.93 46.99,42.16 46.74,41.91 42.93,41.91 38.1,37.08 38.1,32.26 38.86,31.5 42.8,31.5 43.18,31.88 43.18,33.78 43.82,34.42 45.09,34.42 45.72,33.78 45.72,32.38 46.36,31.75 47.62,31.75 52.71,26.67 U2.10 | 46.99,42.93 46.99,45.72 46.48,46.23 37.21,46.23 36.83,46.61 U1.GND3 | J1.A 3.68,6.47 3.68,18.67 | 3.68,18.67 3.68,22.99 3.68,26.04 | 3.68,26.04 3.68,29.97 1.27,32.38 U1.GND1 1.27,35.81 3.17,37.72 3.17,46.35 3.81,46.99 | 56.9,17.14 42.8,17.14 | 42.8,17.14 42.55,16.89 U2.19 42.55,13.34 41.91,12.7 36.45,12.7 | 36.45,12.7 35.81,12.7 33.78,14.73 33.78,18.54 28.7,18.54 | 28.7,18.54 22.35,18.54 20.32,16.51 U3.19 | 15.12,19.95 13.84,18.67 7.49,18.67 | 7.49,18.67 3.68,18.67 | 7.49,18.67 13.54,24.71 17.14,24.71 17.27,24.71 v17.27,26.42 | 56.9,17.14 56.9,20.83 57.4,21.34 57.4,30.23 55.88,31.75 55.88,34.04 46.99,42.93 | C6.1 38.74,15.88 36.45,13.59 36.45,12.7 | v28.57,17.02 28.57,18.41 28.7,18.54 | v42.42,18.54 42.42,17.53 42.8,17.14 | v6.98,26.04 3.68,26.04
  other vias: 3.68,10.54 56.9,11.56
  pour Bottom: 0,9.4 61.09,9.4 61.09,68.58 0,68.58
LED
  Top 0.152: U1.34-RX8 57.15,55.63 J4.3
  Bottom 0.152: R2.2 50.49,60.01 50.8,60.33 50.8,63.5 51.44,64.14 53.98,64.14 57.79,60.33 57.79,58.8 J4.3
LED_R
  Bottom 0.152: D1.A 48.75,63.52 49.15,63.12 R2.1
PHI2  (via drill 0.6)
  Top 0.152: U4.11 15.57,14.28 12.83,11.56 v12.7,11.56
  Bottom 0.152: J1.E 13.72,6.34 13.72,10.54 v12.7,11.56
PHI2_B
  Top 0.152: U4.9 19.56,24.21 19.56,25.65 17.14,28.07 7.87,28.07 6.35,29.59 U1.1-TX1/MISO1/CTX2
R/!W  (via drill 0.6)
  Top 0.152: J1.5 13.97,6.6 13.97,11.43 14.99,12.45 v16.26,12.45 19.18,12.45 19.68,12.95 U4.12 | U5.1 53.34,21.21 v52.58,20.45
  Bottom 0.152: v52.58,20.45 19.68,20.45 18.41,19.18 15.75,19.18 15.24,18.67 15.24,17.91 15.75,17.4 16.76,17.4 17.53,16.64 17.53,13.72 v16.26,12.45
R/!W_B  (via drill 0.6)
  Top 0.152: U4.8 21.08,24.21 21.08,25.4 15.75,30.73 v8,30.73
  Bottom 0.152: v8,30.73 6.1,30.73 U1.0-RX1/CS1/CRX2
VHST
  Top 0.635: U1.+5V 7.62,37.97 10.03,40.39 18.8,40.39 25.4,46.99 25.4,53.59 33.4,61.59 37.25,61.59 J2.5V
  Bottom 0.61: C9.+ 39.75,58.69 J2.5V

### Text on the board
tPlace: TeensyROM | v0.2b | github.com/SensoriumEmbedded/TeensyROM | Top Side
bPlace: FZ: Gettin' tired? / Birdlegs: My fingers got stuck!